# EasyEDA schematic SCH_AI-driven-Air-Quality-Forecasting-Monitoring-System_2026-03-10.json
TITLE: Sheet_1; REV: 1.0; Date: 2026-03-09; Sheet: 1/1; Drawn By: shrikantambat2704; Company: Your Company
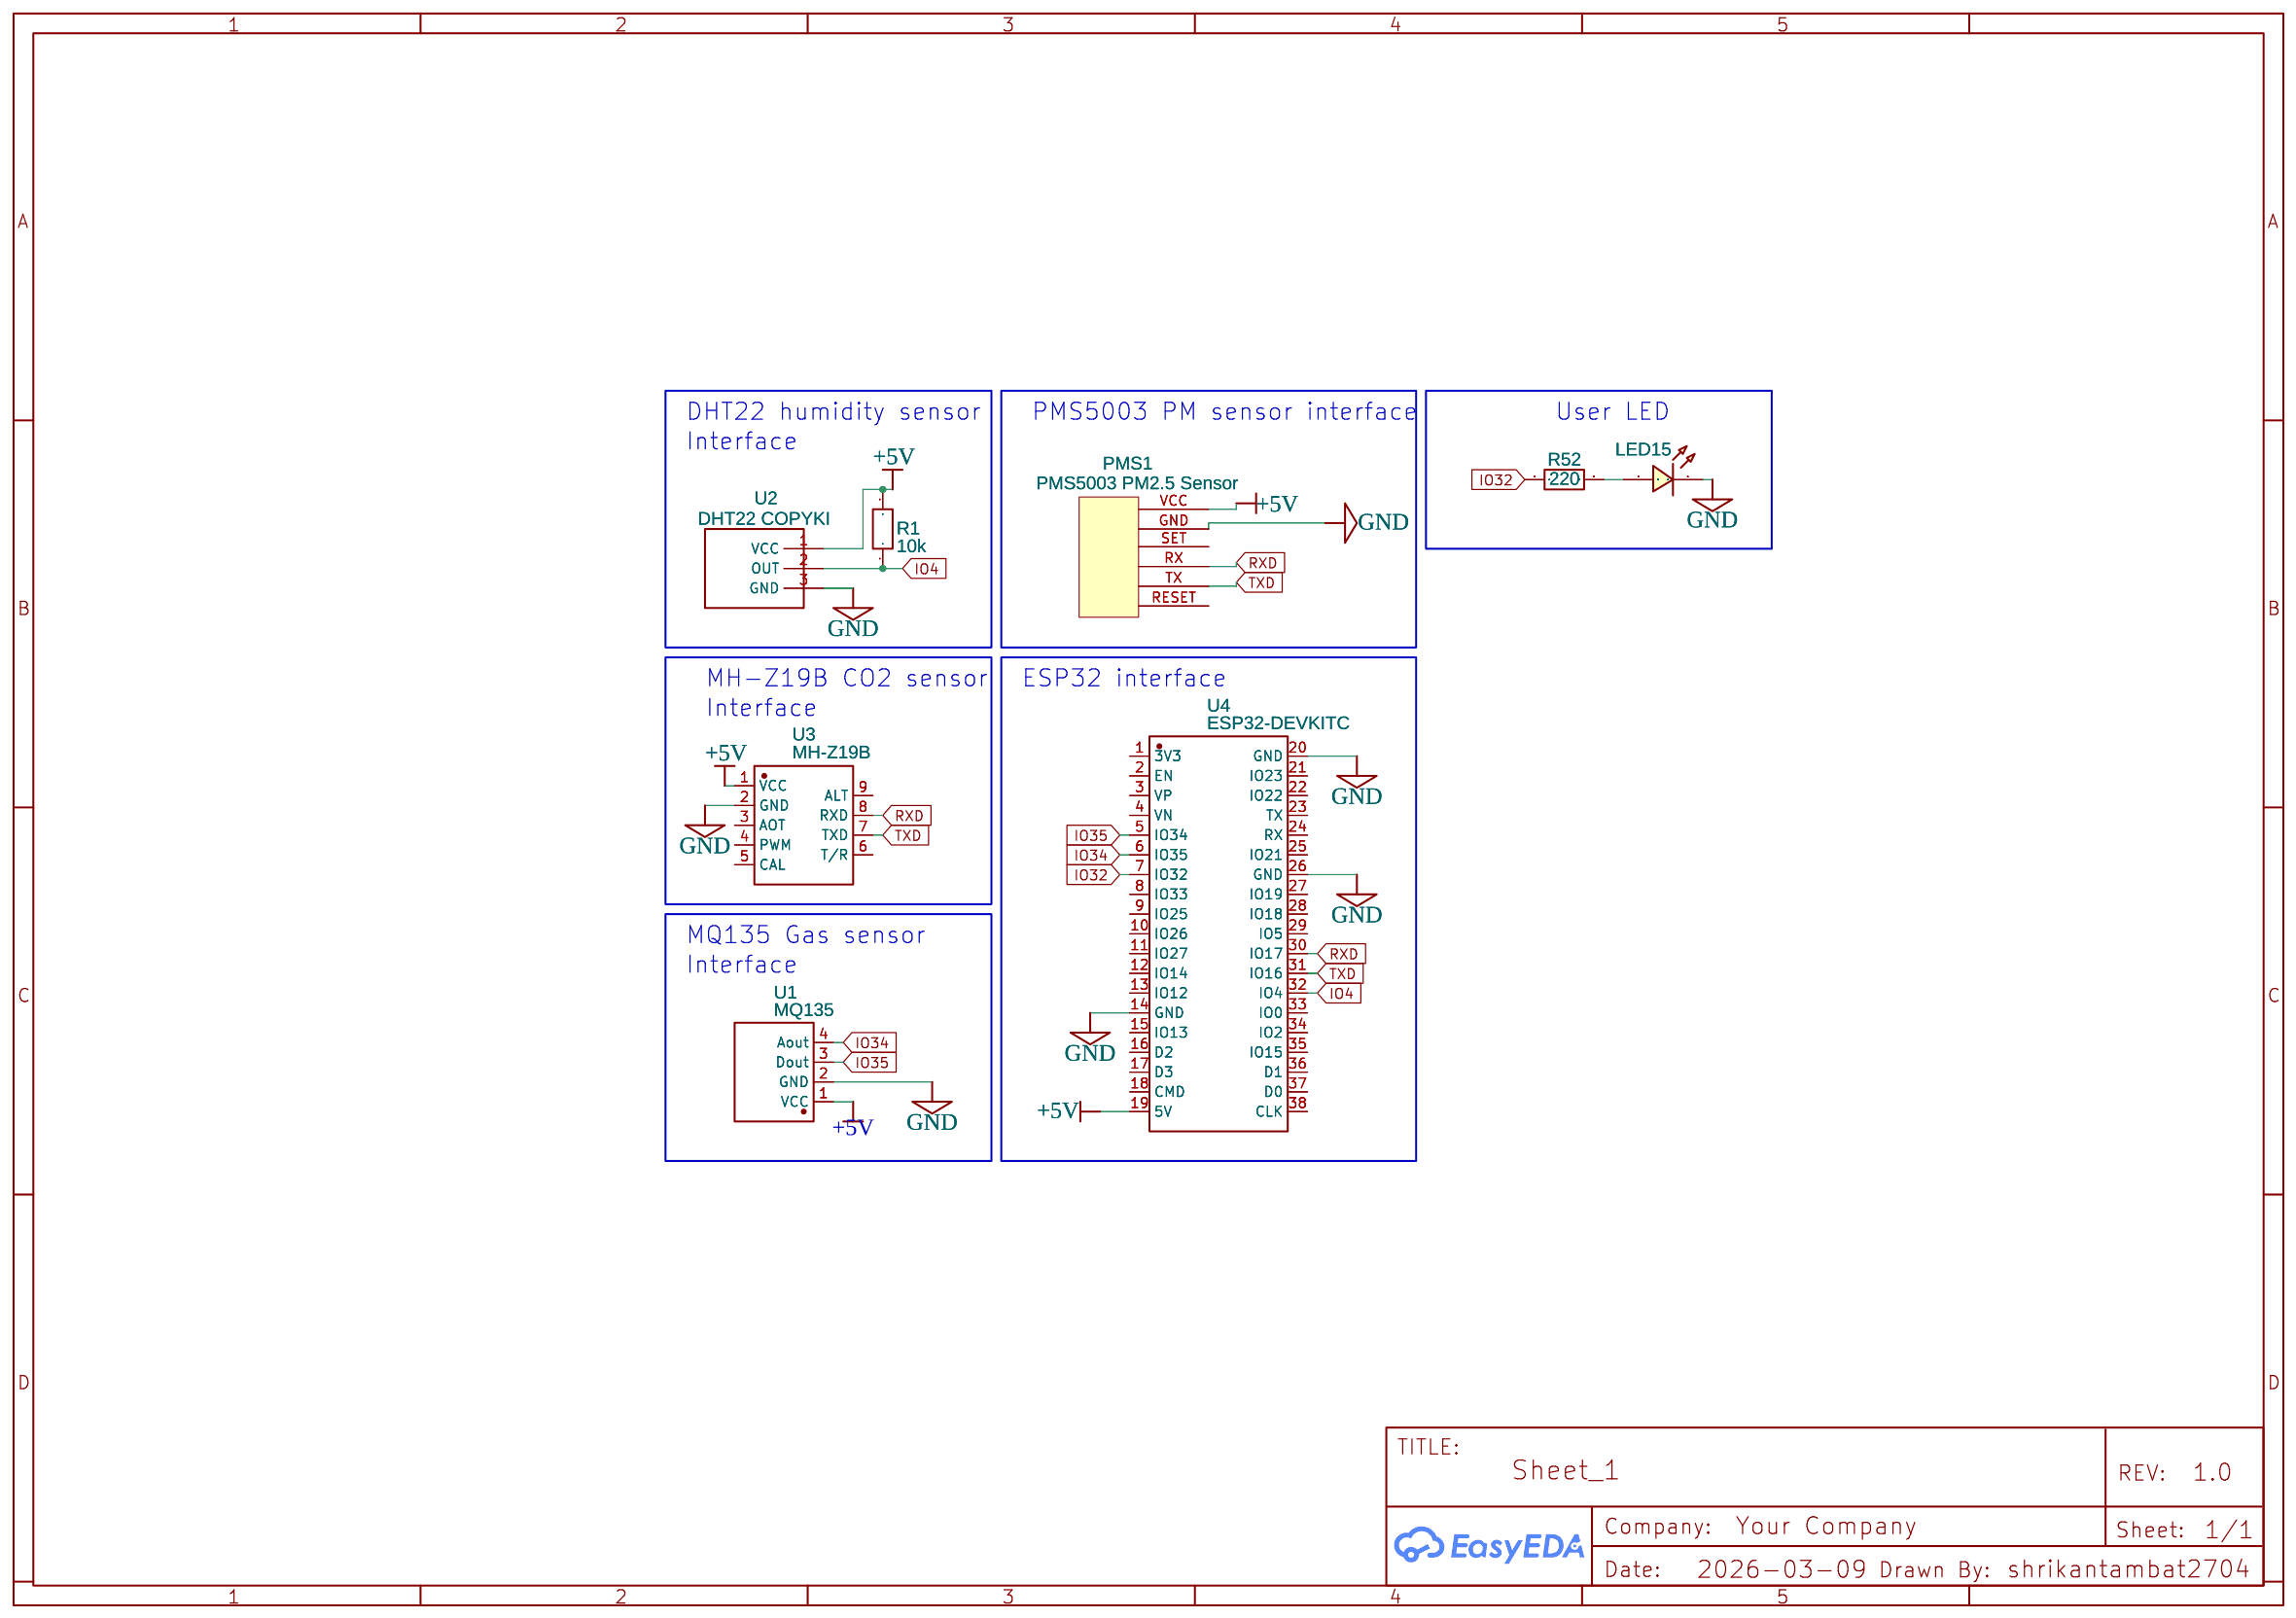
[diagram p0: schematic sheet]

## Parts
LED15  LED-0805_R  [LED0805_RED]
PMS1  PMS5003 PM2.5 Sensor  [PMS5003 PM2.5 SENSOR]
R1  10k  [R_AXIAL-0.4]
R52  220  [R0805]
U1  MQ135  [MQ135]
U2  DHT22 COPYKI  [DHT22]
U3  MH-Z19B  [SENSOR-TH_SY-CO2-MH1001A]
U4  ESP32-DEVKITC  [BULETM-SMD_ESP32-DEVKITC]

## Library data of the parts
LED15 = LED-0805_R: Manufacturer: EVERLIGHT(台湾亿光); Manufacturer Part: 17-21SURC/S530-A3/TR8; Supplier Part: C72037; Contributor: LCEDA_Lib
PMS1 = PMS5003 PM2.5 Sensor: Contributor: shyriu
R1 = R_AXIAL-0.4_EU: Contributor: LCEDA_Lib
R52 = R_0805_EU: Contributor: LCEDA_Lib
U1 = MQ135: Contributor: koustav15
U2 = DHT22 COPYKI: Contributor: morarutheodor
U3 = SY-CO2-MH1001A: Supplier: LCSC; Supplier Part: C22466760; Manufacturer: saiya(赛亚); Manufacturer Part: SY-CO2-28BMI; Contributor: lcsc; JLCPCB Part Class: Extended Part
U4 = ESP32-DEVKITC: Supplier: LCSC; Supplier Part: C571180; Manufacturer: ESPRESSIF(乐鑫); Manufacturer Part: ESP32-DevKitC; Contributor: lcsc

## Nets
+5V: PMS1.VCC R1.2 U1.1(VCC) U2.1(VCC) U3.1(VCC) U4.19(5V)
GND: LED15.2 PMS1.GND U1.2(GND) U2.3(GND) U3.2(GND) U4.14(GND) U4.20(GND) U4.26(GND)
IO4: R1.1 U2.2(OUT) U4.32(IO4)
IO32: R52.1 U4.7(IO32)
IO34: U1.4(Aout) U4.6(IO35)
IO35: U1.3(Dout) U4.5(IO34)
RXD: PMS1.RX U3.8(RXD) U4.30(IO17)
TXD: PMS1.TX U3.7(TXD) U4.31(IO16)
Net-(LED15-1): LED15.1 R52.2

Not connected (* = marked no-connect by the designer): PMS1 RESET SET; U3 3(AOT) 4(PWM) 5(CAL) 6(T/R) 9(ALT); U4 1(3V3) 2(EN) 3(VP) 4(VN) 8(IO33) 9(IO25) 10(IO26) 11(IO27) 12(IO14) 13(IO12) 15(IO13) 16(D2) 17(D3) 18(CMD) 21(IO23) 22(IO22) 23(TX) 24(RX) 25(IO21) 27(IO19) 28(IO18) 29(IO5) 33(IO0) 34(IO2) 35(IO15) 36(D1) 37(D0) 38(CLK)

## Notes on the sheet
- DHT22 humidity sensor
- PMS5003 PM sensor interface
- User LED
- Interface
- MH-Z19B CO2 sensor
- ESP32 interface
- Interface
- MQ135 Gas sensor
- Interface
